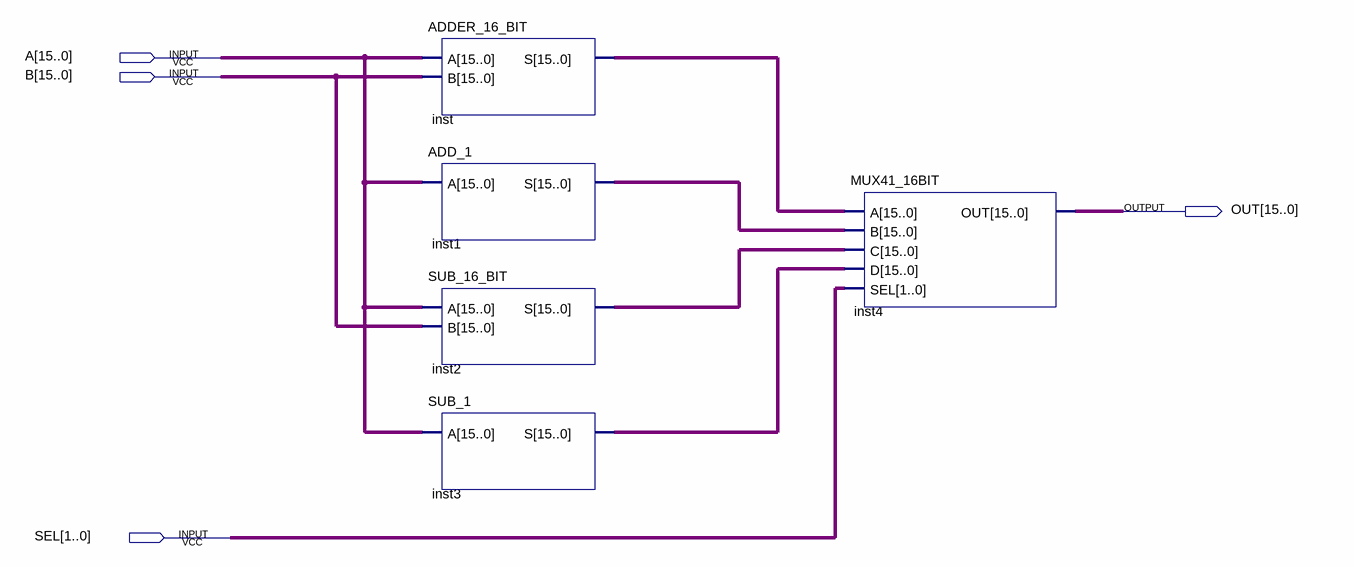
[diagram p0: schematic sheet]
// Quartus schematic AU.bdf as structural Verilog: 5 symbols, 4 pins
module AU (
  input  [15:0] A,
  input  [15:0] B,
  input  [1:0] SEL,
  output [15:0] OUT
);

  wire [15:0] inst1_s, inst2_s, inst3_s, inst_s;

  ADDER_16_BIT inst (.A(A), .B(B), .S(inst_s));
  ADD_1 inst1 (.A(A), .S(inst1_s));
  SUB_16_BIT inst2 (.A(A), .B(B), .S(inst2_s));
  SUB_1 inst3 (.A(A), .S(inst3_s));
  MUX41_16BIT inst4 (.A(inst_s), .B(inst1_s), .C(inst2_s), .D(inst3_s), .SEL(SEL), .OUT(OUT));
endmodule
